# Altium schematic sheet BatteryPack.SchDoc
size A4
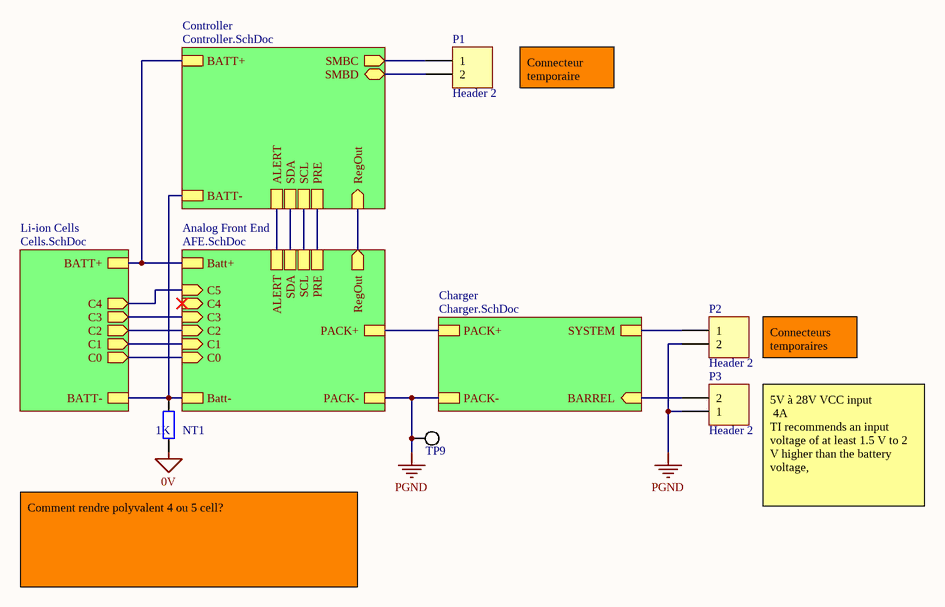
[diagram p0: BatteryPack.SchDoc]

## Parts
NT1  value 1K  [AXIAL-0.4]  (hidden comment: Res2)
P1  Header 2  [HDR1X2]
P2  Header 2  [HDR1X2]
P3  Header 2  [HDR1X2]
TP9  testpoint  [0805 testpoint]  (value not drawn)

## Sub-sheets
Analog Front End = AFE.SchDoc: Batt+, Batt-, RegOut (out), ALERT, SDA, SCL, PRE, PACK+, PACK-, C1 (in), C3 (in), C2 (in), C0 (in), C4 (in), C5 (in)
Charger = Charger.SchDoc: PACK+, SYSTEM, PACK-, BARREL (in)
Controller = Controller.SchDoc: RegOut (in), ALERT, SDA, SCL, PRE, SMBC (out), SMBD (bidir), BATT+, BATT-
Li-ion Cells = Cells.SchDoc: BATT+, BATT-, C1 (out), C3 (out), C2 (out), C0 (out), C4 (out)

## Nets
0V: NT1.1
PGND: P2.2 P3.1 TP9.1 ; sheet Analog Front End/PACK-, sheet Charger/PACK-
NetNT1_2: NT1.2 ; sheet Li-ion Cells/BATT-, sheet Controller/BATT-, sheet Analog Front End/Batt-
NetP1_1: P1.1 ; sheet Controller/SMBC
NetP1_2: P1.2 ; sheet Controller/SMBD
NetP2_1: P2.1 ; sheet Charger/SYSTEM
NetP3_2: P3.2 ; sheet Charger/BARREL
(unnamed): sheet Li-ion Cells/BATT+, sheet Controller/BATT+, sheet Analog Front End/Batt+
(unnamed): sheet Li-ion Cells/C1, sheet Analog Front End/C1
(unnamed): sheet Li-ion Cells/C3, sheet Analog Front End/C3
(unnamed): sheet Li-ion Cells/C2, sheet Analog Front End/C2
(unnamed): sheet Li-ion Cells/C0, sheet Analog Front End/C0
(unnamed): sheet Li-ion Cells/C4, sheet Analog Front End/C5
(unnamed): sheet Controller/RegOut, sheet Analog Front End/RegOut
(unnamed): sheet Controller/ALERT, sheet Analog Front End/ALERT
(unnamed): sheet Controller/SDA, sheet Analog Front End/SDA
(unnamed): sheet Controller/SCL, sheet Analog Front End/SCL
(unnamed): sheet Controller/PRE, sheet Analog Front End/PRE
(unnamed): sheet Analog Front End/PACK+, sheet Charger/PACK+

## Notes on the sheet
- Connecteur temporaire
- Connecteurs temporaires
- 5V à 28V VCC input
  4A
  TI recommends an input voltage of at least 1.5 V to 2 V higher than the battery voltage,
- Comment rendre polyvalent 4 ou 5 cell?

## Library data of the parts
NT1 = Res2: Resistor; Published: 8-Jun-2000; LatestRevisionDate: 17-Jul-2002; LatestRevisionNote: Re-released for DXP Platform.; PackageReference: AXIAL-0.4; Publisher: Altium Limited; PackageDescription: Axial Device, Thru-Hole; 2 Leads; 0.4 in Pin Spacing
P1-P3 = Header 2: Header, 2-Pin; LatestRevisionDate: 17-Jul-2002; LatestRevisionNote: Re-released for DXP Platform.; Publisher: Altium Limited